# EAGLE schematic schema_vysilac (EAGLE 7.6.0)
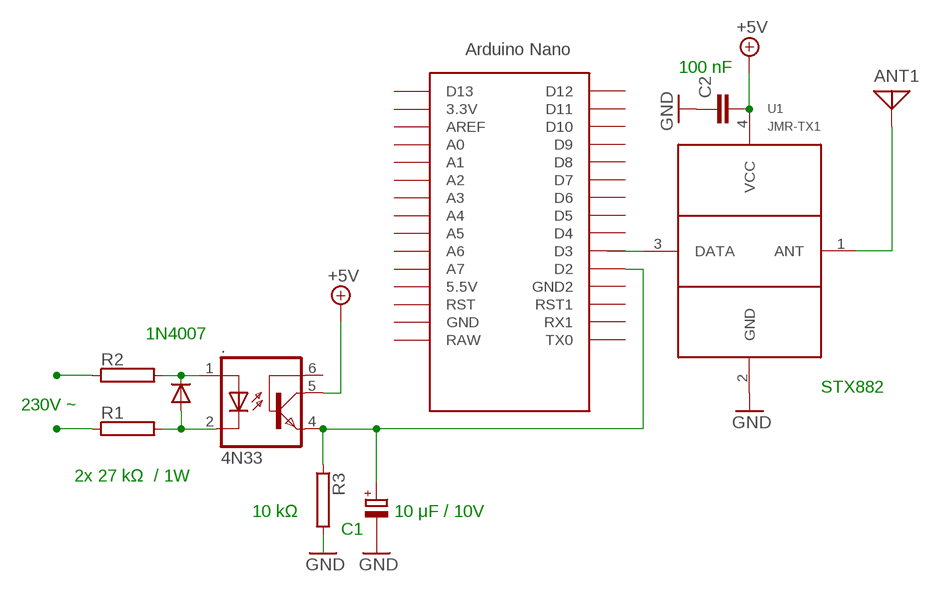
[diagram p0: schematic, sheet 1]

## Parts
.  4N33  4N37  [DIL06]
ANT1  ANTENNA  [PAD-01]
C2  C5/5.5  [C5B5.5]
R1  RAC03  [AC03]
R2  RAC03  [AC03]
R3  RAC03  [AC03]
U1  JMR-TX1  [JMR-TX1]
U$1  NANO  [NANO]

## Nets
+5V: ..5(COL) C2.2 U1.4(VCC)
GND: C2.1 R3.2 U1.2(GND)
N$1: ..1(A) R2.2
N$2: ..2(C) R1.2
N$3: ..4(EMI) R3.1
N$4: U$1.D2
N$5: R2.1
N$6: R1.1
N$7: U1.3(DATA)
N$10: ANT1.1 U1.1(ANT)
Unconnected: ..6(BAS) U$1.3.3V U$1.5V(5.5V) U$1.A0 U$1.A1 U$1.A2 U$1.A3 U$1.A4 U$1.A5 U$1.A6 U$1.A7 U$1.AREF U$1.D3 U$1.D4 U$1.D5 U$1.D6 U$1.D7 U$1.D8 U$1.D9 U$1.D10 U$1.D11 U$1.D12 U$1.D13 U$1.GND U$1.GND1(GND2) U$1.ICSP1 U$1.ICSP2 U$1.ICSP3 U$1.ICSP4 U$1.ICSP5 U$1.ICSP6 U$1.RAW U$1.RST U$1.RST1 U$1.RX1 U$1.TX0

## Notes on the sheet
- 100 nF
- 1N4007
- STX882
- 230V ~
- 2x 27 kΩ  / 1W
- 10 kΩ | 10 μF / 10V
- C1

## Library data of the parts
. = optocoupler:4N37: OPTO COUPLER Source: http://www.fairchildsemi.com/pf/4N/4N35-M.html; MF: FAIRCHILD SEMICONDUCTOR; MPN: 4N37; OC_FARNELL: 1612456; OC_NEWARK: 72K9948
ANT1 = discrete:ANTENNA: Antenna
C2 = capacitor-wima:C: CAPACITOR naming: grid - package width
R1-R3 = resistor-power:R: Power Resitor; OC_FARNELL: unknown; OC_NEWARK: unknown
U1 = JMR_RF_Lib:JMR-TX1
U$1 = Arduino-clone:NANO: Arduino Nano